# Altium schematic sheet Flash-Memory.SchDoc
size B; SheetNumber: 10; SheetTotal: 12
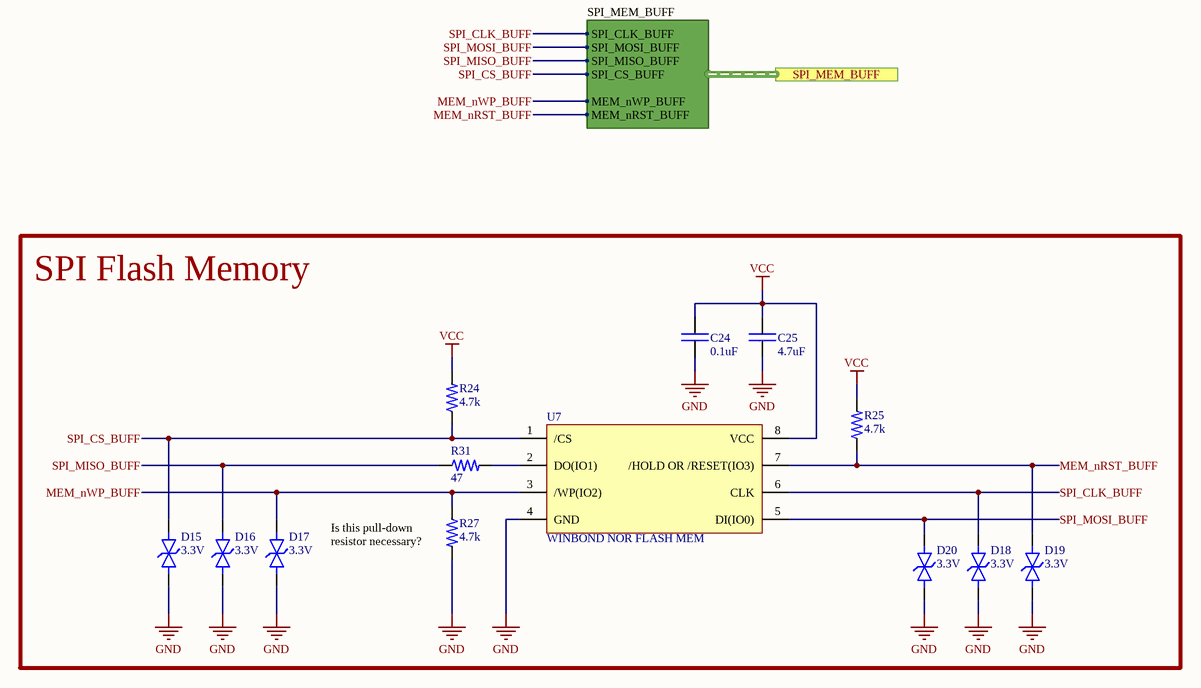
[diagram p0: Flash-Memory.SchDoc]

## Parts
C24  value 0.1uF  [0402C]  (hidden comment: CAP)
C25  value 4.7uF  [0402C]  (hidden comment: CAP)
D15  VRS: 3.3V  [0402-TVS]  (hidden comment: DESD3V3E1BL-7B)
D16  VRS: 3.3V  [0402-TVS]  (hidden comment: DESD3V3E1BL-7B)
D17  VRS: 3.3V  [0402-TVS]  (hidden comment: DESD3V3E1BL-7B)
D18  VRS: 3.3V  [0402-TVS]  (hidden comment: DESD3V3E1BL-7B)
D19  VRS: 3.3V  [0402-TVS]  (hidden comment: DESD3V3E1BL-7B)
D20  VRS: 3.3V  [0402-TVS]  (hidden comment: DESD3V3E1BL-7B)
R24  value 4.7k  [0402R]  (hidden comment: RES)
R25  value 4.7k  [0402R]  (hidden comment: RES)
R27  value 4.7k  [0402R]  (hidden comment: RES)
R31  value 47  [0402R]  (hidden comment: RES)
U7  WINBOND NOR FLASH MEM  [8-SOIC]

## Blocks framed on the sheet
SPI Flash Memory: C24 C25 D15-D20 R24 R25 R27 R31 U7

## Ports
SPI_MEM_BUFF (harness SPI_MEM_BUFF, see Brain-PCB_MASTER[2C], Isolation-Buffers[4B])

## Harnesses
SPI_MEM_BUFF: SPI_CLK_BUFF, SPI_MOSI_BUFF, SPI_MISO_BUFF, SPI_CS_BUFF, MEM_nWP_BUFF, MEM_nRST_BUFF

## Nets
GND: C24.1 C25.1 D15.2 D16.2 D17.2 D18.2 D19.2 D20.2 R27.2 U7.4(GND)
VCC: C24.2 C25.2 R24.2 R25.2 U7.8(VCC)
MEM_nRST_BUFF: D19.1 R25.1 U7.7(/HOLD_OR_/RESET(IO3)) ; port SPI_MEM_BUFF.MEM_nRST_BUFF
MEM_nWP_BUFF: D17.1 R27.1 U7.3(/WP(IO2)) ; port SPI_MEM_BUFF.MEM_nWP_BUFF
SPI_CLK_BUFF: D18.1 U7.6(CLK) ; port SPI_MEM_BUFF.SPI_CLK_BUFF
SPI_CS_BUFF: D15.1 R24.1 U7.1(/CS) ; port SPI_MEM_BUFF.SPI_CS_BUFF
SPI_MISO_BUFF: D16.1 R31.1 ; port SPI_MEM_BUFF.SPI_MISO_BUFF
SPI_MOSI_BUFF: D20.1 U7.5(DI(IO0)) ; port SPI_MEM_BUFF.SPI_MOSI_BUFF
NetR31_2: R31.2 U7.2(DO(IO1))

## Notes on the sheet
- (near R27) Is this pull-down resistor necessary?

## Library data of the parts
C24 = CAP: Capacitor; MFR: Murata Electronics; MFR PN: GRM155R71C104KA88J; Type: SMD; Vendor: *; Vendor PN: *; Vendor Link: *
C25 = CAP: Capacitor; MFR: Murata Electronics; MFR PN: GRM155D81C475ME15J; Type: SMD; Vendor: *; Vendor PN: *; Vendor Link: *
D15-D20 = TVS Diode 3.3V Bi: TVS DIODE 3.3VWM 7VC DFN1006-2; MFR: Diodes Incorporated; Type: SMD; VBR: 3.8V; VC: 7V; MFR PN: DESD3V3E1BL-7B
R24 R25 R27 = RES: Resistor; MFR PN: AC0402FR-134K7L; MFR: YAGEO; Vendor: *; Vendor PN: *; Vendor Link: *; Type: SMD
R31 = RES: Resistor; MFR PN: RC0402FR-0747RL; MFR: YAGEO; Vendor: *; Vendor PN: *; Vendor Link: *; Type: SMD
U7 = WINBOND NOR FLASH MEM: FLASH - NOR Memory IC SPI; MFR PN: W25Q128JVSIM; MFR: Winbond; Type: SMD; Value: *